# EAGLE board driver (EAGLE 9.4.2)
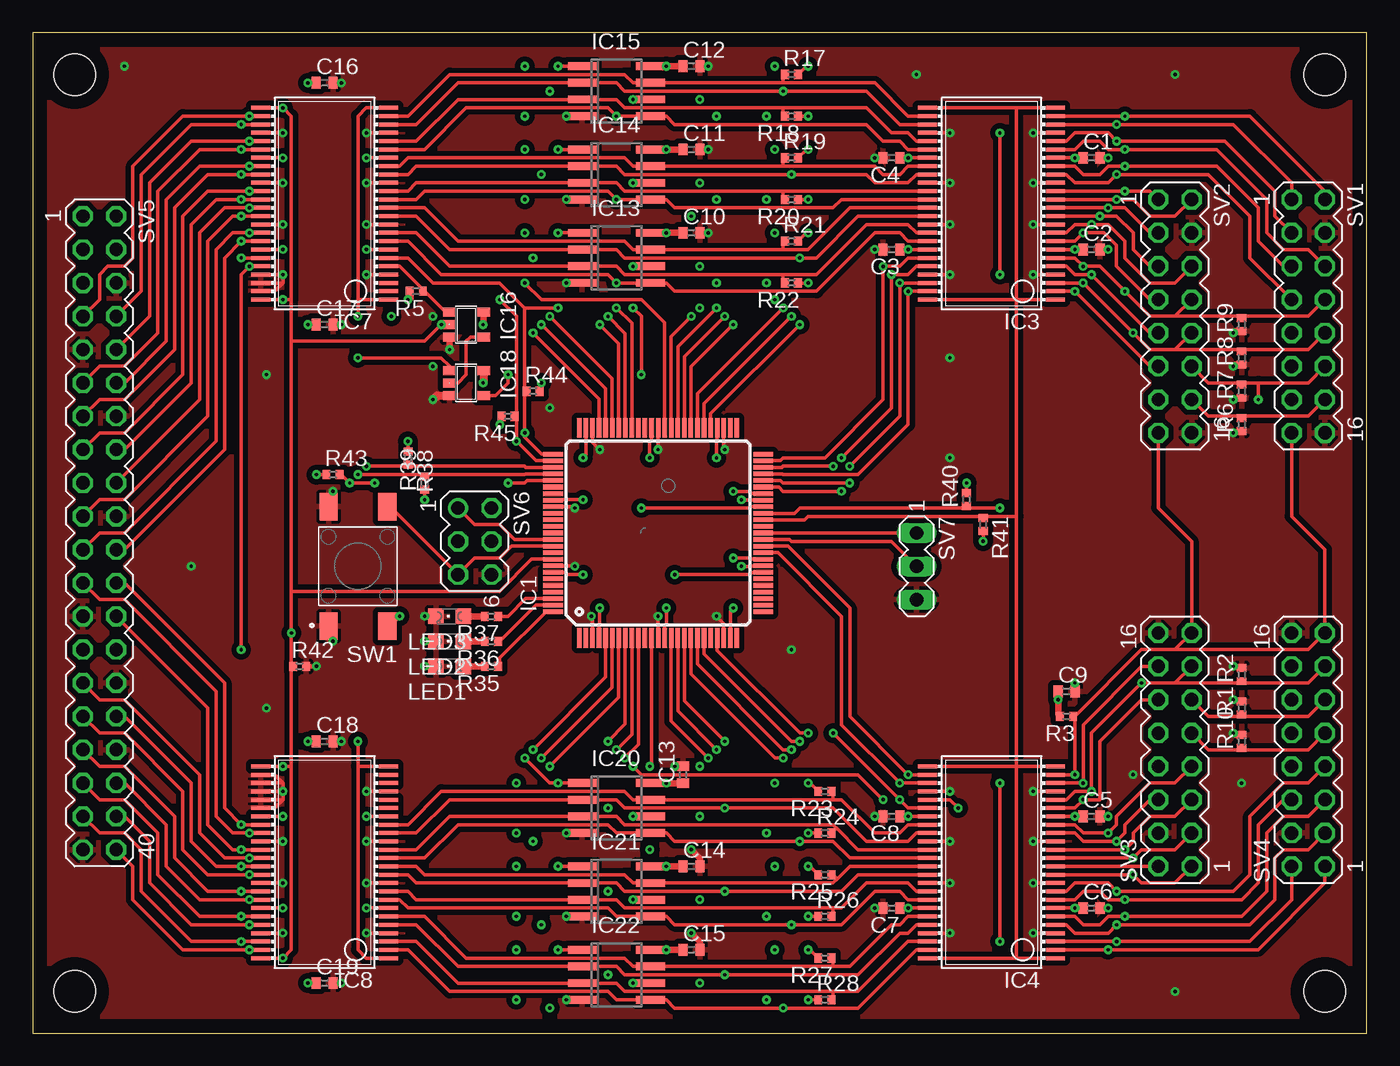
[diagram p2: board, top side]
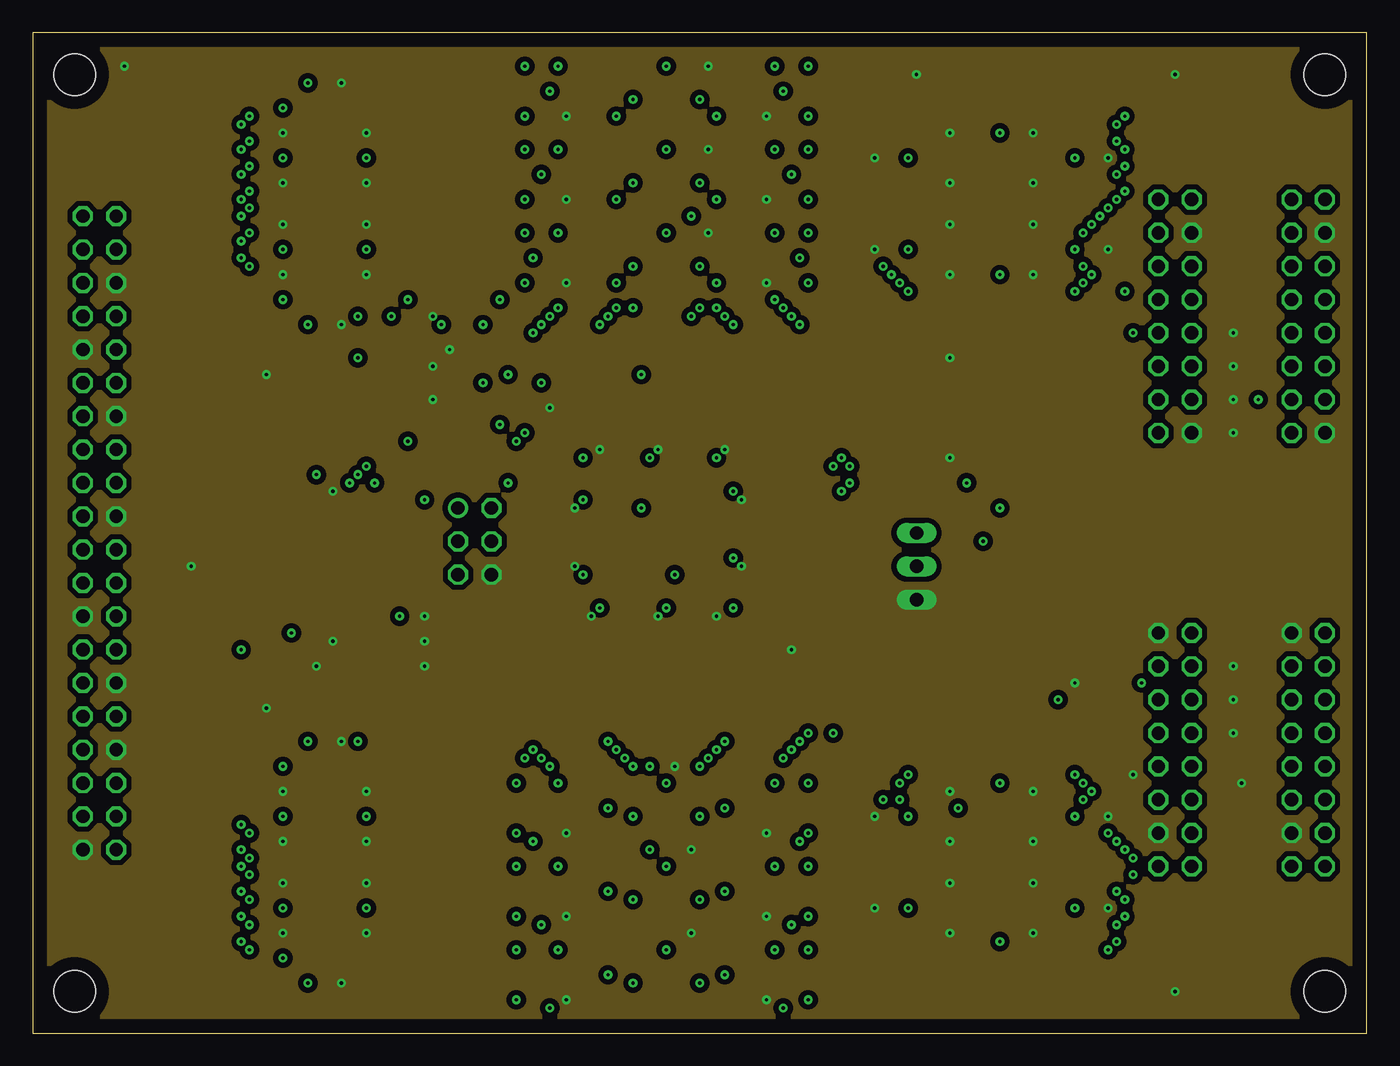
[diagram p3: board, inner layer Route2]
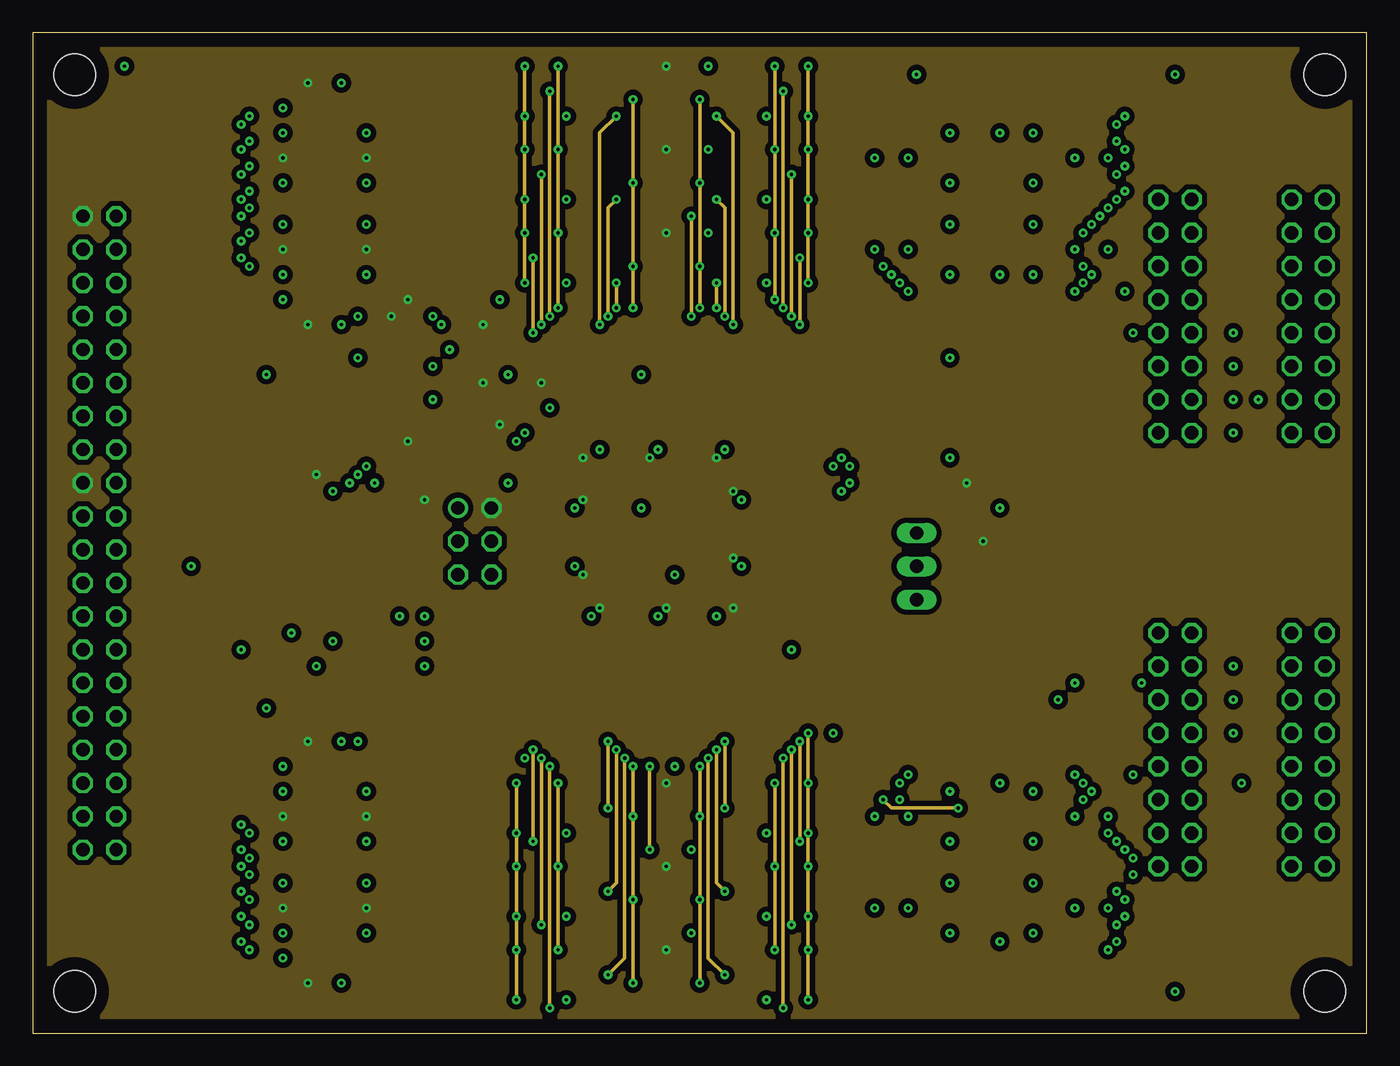
[diagram p4: board, inner layer Route15]
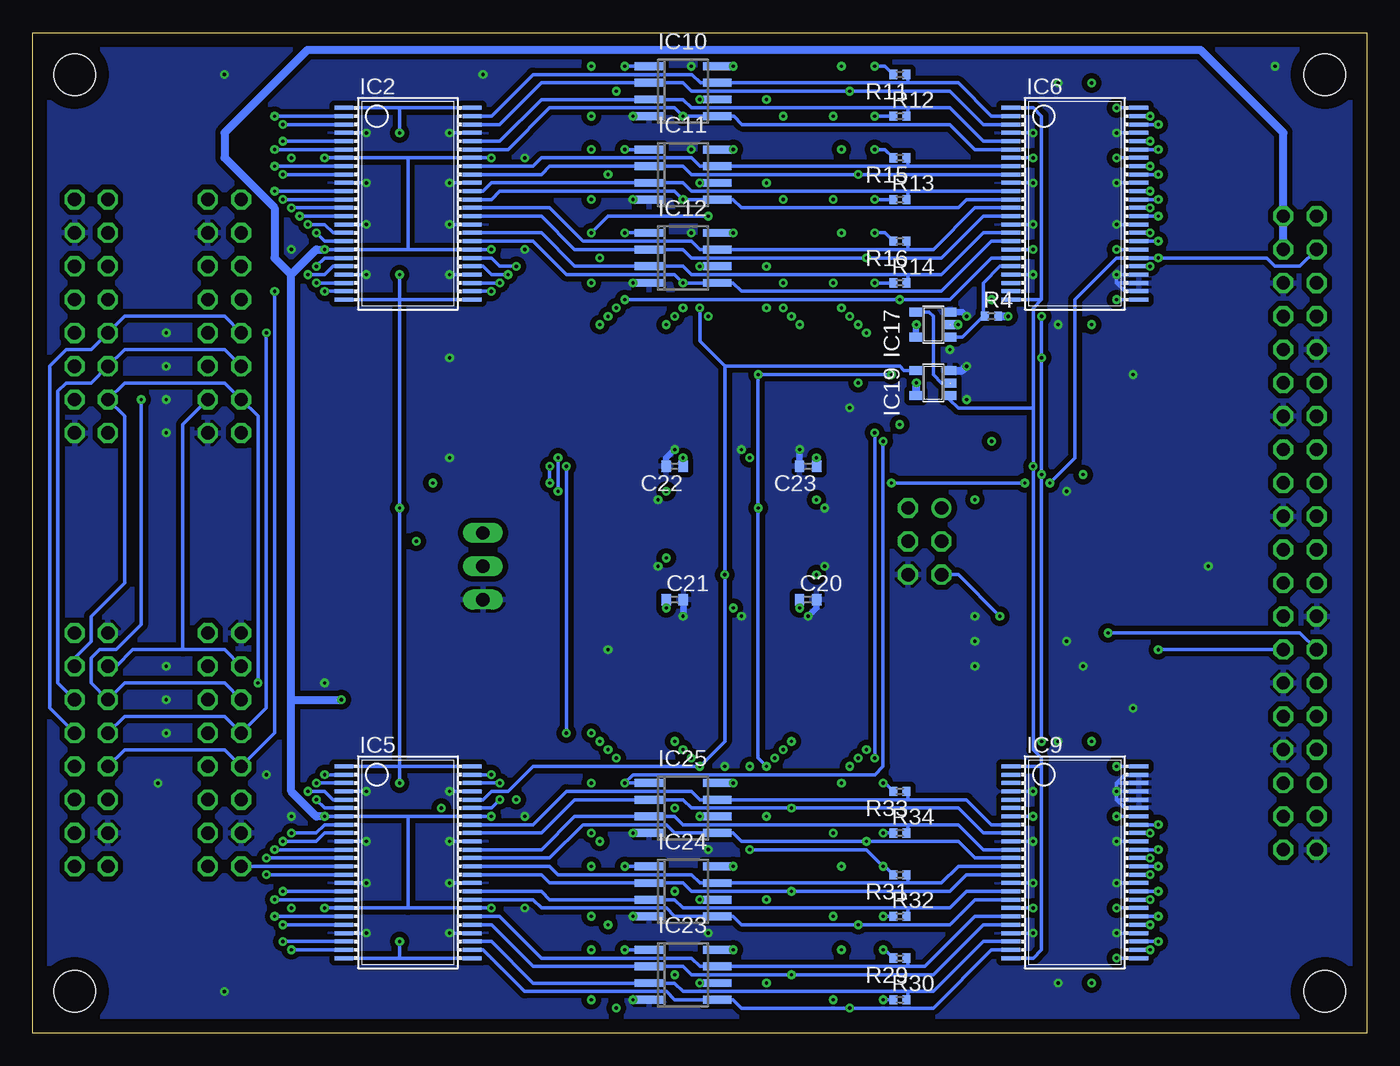
[diagram p5: board, bottom side, seen from below]

Size 101.6 x 76.2 mm. Coordinates in mm from the lower left corner, seen from the top.
Outline: 0,76.2 0,0 101.6,0 101.6,76.2 0,76.2
Copper layers (1*2*15*16): Top 0.035mm / dielectric 0.5mm / Route2 0.035mm / dielectric 0.5mm / Route15 0.035mm / dielectric 0.5mm / Bottom 0.035mm
Design rules "66each *": minimum track width 5mil, minimum drill 10mil, track to track 5mil, track to pad 5mil, pad to pad 5mil, via to via 5mil, smd to smd 5mil, copper to edge 40mil, drill to drill 8mil, minimum pad ring 10mil, minimum via ring 8mil, stop-mask expansion 4mil, vias tented up to drill 0mil, thermal gap 10mil
Holes 3.17 mm at 98.42,73.03 3.17,73.03 98.42,3.17 3.17,3.17

## Footprints (pad centres in the part's own frame; a part is rotated, then mirrored left to right if it is on the bottom)
C0402 = smd 0.7 x 0.9: 1 -0.65,0; 2 0.65,0
TQFP100 = smd 1.5 x 0.35: 1 -8,6; 2 -8,5.5; 3 -8,5; 4 -8,4.5; 5 -8,4; 6 -8,3.5; 7 -8,3; 8 -8,2.5; 9 -8,2; 10 -8,1.5; 11 -8,1; 12 -8,0.5; 13 -8,0; 14 -8,-0.5; 15 -8,-1; 16 -8,-1.5; 17 -8,-2; 18 -8,-2.5; 19 -8,-3; 20 -8,-3.5; 21 -8,-4; 22 -8,-4.5; 23 -8,-5; 24 -8,-5.5; 25 -8,-6; 51 8,-6; 52 8,-5.5; 53 8,-5; 54 8,-4.5; 55 8,-4; 56 8,-3.5; 57 8,-3; 58 8,-2.5; 59 8,-2; 60 8,-1.5; 61 8,-1; 62 8,-0.5; 63 8,0; 64 8,0.5; 65 8,1; 66 8,1.5; 67 8,2; 68 8,2.5; 69 8,3; 70 8,3.5; 71 8,4; 72 8,4.5; 73 8,5; 74 8,5.5; 75 8,6 | smd 0.35 x 1.5: 26 -6,-8; 27 -5.5,-8; 28 -5,-8; 29 -4.5,-8; 30 -4,-8; 31 -3.5,-8; 32 -3,-8; 33 -2.5,-8; 34 -2,-8; 35 -1.5,-8; 36 -1,-8; 37 -0.5,-8; 38 0,-8; 39 0.5,-8; 40 1,-8; 41 1.5,-8; 42 2,-8; 43 2.5,-8; 44 3,-8; 45 3.5,-8; 46 4,-8; 47 4.5,-8; 48 5,-8; 49 5.5,-8; 50 6,-8; 76 6,8; 77 5.5,8; 78 5,8; 79 4.5,8; 80 4,8; 81 3.5,8; 82 3,8; 83 2.5,8; 84 2,8; 85 1.5,8; 86 1,8; 87 0.5,8; 88 0,8; 89 -0.5,8; 90 -1,8; 91 -1.5,8; 92 -2,8; 93 -2.5,8; 94 -3,8; 95 -3.5,8; 96 -4,8; 97 -4.5,8; 98 -5,8; 99 -5.5,8; 100 -6,8
SSOP48DL = smd 0.305 x 1.422: 1 -6.985,-4.877; 2 -6.35,-4.877; 3 -5.715,-4.877; 4 -5.08,-4.877; 5 -4.445,-4.877; 6 -3.81,-4.877; 7 -3.175,-4.877; 8 -2.54,-4.877; 9 -1.905,-4.877; 10 -1.27,-4.877; 11 -0.635,-4.877; 12 0,-4.877; 13 0.635,-4.877; 14 1.27,-4.877; 15 1.905,-4.877; 16 2.54,-4.877; 17 3.175,-4.877; 18 3.81,-4.877; 19 4.445,-4.877; 20 5.08,-4.877; 21 5.715,-4.877; 22 6.35,-4.877; 23 6.985,-4.877; 24 7.62,-4.877; 25 7.62,4.877; 26 6.985,4.877; 27 6.35,4.877; 28 5.715,4.877; 29 5.08,4.877; 30 4.445,4.877; 31 3.81,4.877; 32 3.175,4.877; 33 2.54,4.877; 34 1.905,4.877; 35 1.27,4.877; 36 0.635,4.877; 37 0,4.877; 38 -0.635,4.877; 39 -1.27,4.877; 40 -1.905,4.877; 41 -2.54,4.877; 42 -3.175,4.877; 43 -3.81,4.877; 44 -4.445,4.877; 45 -5.08,4.877; 46 -5.715,4.877; 47 -6.35,4.877; 48 -6.985,4.877
SO08 = smd 0.6 x 2.2: 1 -1.905,-2.6; 2 -0.635,-2.6; 3 0.635,-2.6; 4 1.905,-2.6; 5 1.905,2.6; 6 0.635,2.6; 7 -0.635,2.6; 8 -1.905,2.6
SOT23-5 = smd 0.69 x 0.99: 1 -0.95,-1.29; 2 0,-1.29; 3 0.95,-1.29; 4 0.95,1.3; 5 -0.95,1.3
CHIPLED_0805 = smd 1.2 x 1.2: A 0,-1.05; C 0,1.05
R0402 = smd 0.6 x 0.7: 1 -0.5,0; 2 0.5,0
MA08-2 = drill 1.016 octagon: 1 -8.89,-1.27; 2 -8.89,1.27; 3 -6.35,-1.27; 4 -6.35,1.27; 5 -3.81,-1.27; 6 -3.81,1.27; 7 -1.27,-1.27; 8 -1.27,1.27; 9 1.27,-1.27; 10 1.27,1.27; 11 3.81,-1.27; 12 3.81,1.27; 13 6.35,-1.27; 14 6.35,1.27; 15 8.89,-1.27; 16 8.89,1.27
MA20-2 = drill 1.016 octagon: 1 -24.13,-1.27; 2 -24.13,1.27; 3 -21.59,-1.27; 4 -21.59,1.27; 5 -19.05,-1.27; 6 -19.05,1.27; 7 -16.51,-1.27; 8 -16.51,1.27; 9 -13.97,-1.27; 10 -13.97,1.27; 11 -11.43,-1.27; 12 -11.43,1.27; 13 -8.89,-1.27; 14 -8.89,1.27; 15 -6.35,-1.27; 16 -6.35,1.27; 17 -3.81,-1.27; 18 -3.81,1.27; 19 -1.27,-1.27; 20 -1.27,1.27; 21 1.27,-1.27; 22 1.27,1.27; 23 3.81,-1.27; 24 3.81,1.27; 25 6.35,-1.27; 26 6.35,1.27; 27 8.89,-1.27; 28 8.89,1.27; 29 11.43,-1.27; 30 11.43,1.27; 31 13.97,-1.27; 32 13.97,1.27; 33 16.51,-1.27; 34 16.51,1.27; 35 19.05,-1.27; 36 19.05,1.27; 37 21.59,-1.27; 38 21.59,1.27; 39 24.13,-1.27; 40 24.13,1.27
MA03-2 = drill 1.016: 1 -2.54,-1.27 | drill 1.016 octagon: 2 -2.54,1.27; 3 0,-1.27; 4 0,1.27; 5 2.54,-1.27; 6 2.54,1.27
MA03-1 = drill 1.016 long: 1 -2.54,0; 2 0,0; 3 2.54,0
FSM2JSMA = smd 1.4 x 2.1: 1 2.23,4.55; 2 2.23,-4.55; 3 -2.23,4.55; 4 -2.23,-4.55

## Placement (x,y rotation side)
C1  100n  [C0402]  80.64,66.67 0 top
C2  100n  [C0402]  80.64,59.69 0 top
C3  100n  [C0402]  65.41,59.69 180 top
C4  100n  [C0402]  65.41,66.67 180 top
C5  100n  [C0402]  80.64,16.51 0 top
C6  100n  [C0402]  80.64,9.53 0 top
C7  100n  [C0402]  65.41,9.53 180 top
C8  100n  [C0402]  65.41,16.51 180 top
C9  100n  [C0402]  78.74,26.04 0 top
C10  100n  [C0402]  50.16,60.96 0 top
C11  100n  [C0402]  50.16,67.31 0 top
C12  100n  [C0402]  50.16,73.66 0 top
C13  100n  [C0402]  49.53,19.68 90 top
C14  100n  [C0402]  50.16,12.7 0 top
C15  100n  [C0402]  50.16,6.35 0 top
C16  100n  [C0402]  22.23,72.39 0 top
C17  100n  [C0402]  22.23,53.98 0 top
C18  100n  [C0402]  22.23,22.23 0 top
C19  100n  [C0402]  22.23,3.81 0 top
C20  100n  [C0402]  42.55,33.02 0 bottom
C21  100n  [C0402]  52.7,33.02 0 bottom
C22  100n  [C0402]  52.7,43.18 180 bottom
C23  100n  [C0402]  42.55,43.18 180 bottom
IC1  XMEGA128A1  [TQFP100]  47.62,38.1 90 top
IC2  74AC16244  [SSOP48DL]  73.03,63.5 270 bottom
IC3  74AC16244  [SSOP48DL]  73.03,62.87 90 top
IC4  74AC16244  [SSOP48DL]  73.03,12.7 90 top
IC5  74AC16244  [SSOP48DL]  73.03,13.34 270 bottom
IC6  74AC16374  [SSOP48DL]  22.23,63.5 270 bottom
IC7  74AC16374  [SSOP48DL]  22.23,62.87 90 top
IC8  74AC16374  [SSOP48DL]  22.23,12.7 90 top
IC9  74AC16374  [SSOP48DL]  22.23,13.34 270 bottom
IC10  ST95P08M  [SO08]  52.07,71.75 270 bottom
IC11  ST95P08M  [SO08]  52.07,65.41 270 bottom
IC12  ST95P08M  [SO08]  52.07,59.05 270 bottom
IC13  ST95P08M  [SO08]  44.45,59.05 270 top
IC14  ST95P08M  [SO08]  44.45,65.41 270 top
IC15  ST95P08M  [SO08]  44.45,71.75 270 top
IC16  74AHC1G02DBV  [SOT23-5]  33.02,53.98 270 top
IC17  74AHC1G02DBV  [SOT23-5]  33.02,53.98 90 bottom
IC18  74AHC1G125DBV  [SOT23-5]  33.02,49.53 270 top
IC19  74AHC1G125DBV  [SOT23-5]  33.02,49.53 90 bottom
IC20  ST95P08M  [SO08]  44.45,17.14 270 top
IC21  ST95P08M  [SO08]  44.45,10.79 270 top
IC22  ST95P08M  [SO08]  44.45,4.45 270 top
IC23  ST95P08M  [SO08]  52.07,4.45 270 bottom
IC24  ST95P08M  [SO08]  52.07,10.79 270 bottom
IC25  ST95P08M  [SO08]  52.07,17.14 270 bottom
LED1  [CHIPLED_0805]  31.75,27.94 90 top
LED2  [CHIPLED_0805]  31.75,29.84 90 top
LED3  [CHIPLED_0805]  31.75,31.75 90 top
R1  47k  [R0402]  92.08,24.77 90 top
R2  47k  [R0402]  92.08,27.3 90 top
R3  47k  [R0402]  78.74,24.13 180 top
R4  33k  [R0402]  28.57,54.61 0 bottom
R5  33k  [R0402]  29.21,56.52 180 top
R6  47k  [R0402]  92.08,46.35 90 top
R7  47k  [R0402]  92.08,48.9 90 top
R8  47k  [R0402]  92.08,51.44 90 top
R9  47k  [R0402]  92.08,53.98 90 top
R10  47k  [R0402]  92.08,22.23 90 top
R11  33k  [R0402]  35.56,73.03 180 bottom
R12  33k  [R0402]  35.56,69.85 0 bottom
R13  33k  [R0402]  35.56,63.5 0 bottom
R14  33k  [R0402]  35.56,57.15 0 bottom
R15  33k  [R0402]  35.56,66.67 180 bottom
R16  33k  [R0402]  35.56,60.33 180 bottom
R17  33k  [R0402]  57.78,73.03 0 top
R18  33k  [R0402]  57.78,69.85 180 top
R19  33k  [R0402]  57.78,66.67 0 top
R20  33k  [R0402]  57.78,63.5 180 top
R21  33k  [R0402]  57.78,60.33 0 top
R22  33k  [R0402]  57.78,57.15 180 top
R23  33k  [R0402]  60.33,18.41 180 top
R24  33k  [R0402]  60.33,15.24 0 top
R25  33k  [R0402]  60.33,12.06 180 top
R26  33k  [R0402]  60.33,8.89 0 top
R27  33k  [R0402]  60.33,5.71 180 top
R28  33k  [R0402]  60.33,2.54 0 top
R29  33k  [R0402]  35.56,5.71 180 bottom
R30  33k  [R0402]  35.56,2.54 0 bottom
R31  33k  [R0402]  35.56,12.06 180 bottom
R32  33k  [R0402]  35.56,8.89 0 bottom
R33  33k  [R0402]  35.56,18.41 180 bottom
R34  33k  [R0402]  35.56,15.24 0 bottom
R35  330  [R0402]  34.92,27.94 180 top
R36  330  [R0402]  34.92,29.84 180 top
R37  330  [R0402]  34.92,31.75 180 top
R38  33k  [R0402]  28.57,43.81 270 top
R39  33k  [R0402]  29.84,41.91 90 top
R40  33k  [R0402]  71.12,40.64 90 top
R41  33k  [R0402]  72.39,38.73 270 top
R42  33k  [R0402]  20.32,27.94 0 top
R43  33k  [R0402]  22.86,42.55 0 top
R44  33k  [R0402]  38.1,48.9 0 top
R45  33k  [R0402]  36.2,46.99 180 top
SV1  [MA08-2]  97.16,54.61 270 top
SV2  [MA08-2]  87,54.61 270 top
SV3  [MA08-2]  87,21.59 90 top
SV4  [MA08-2]  97.16,21.59 90 top
SV5  [MA20-2]  5.08,38.1 270 top
SV6  [MA03-2]  33.66,37.47 270 top
SV7  [MA03-1]  67.31,35.56 270 top
SW1  FSM2JSMA  [FSM2JSMA]  24.77,35.56 180 top

## Tracks (layer width: path | path; a pad name or v marks a point on that pad's centre or on a via)
!CS0  (via drill 0.25)
  Top 0.254: IC1.77 38.31,43.6 v36.83,45.09 36.83,46.99 | 36.83,46.99 36.83,54.61 v35.56,55.88 | R45.1 36.83,46.99
  Route15 0.254: v56.52,73.66 v56.52,67.31 v56.52,60.96 v56.52,55.88 | v56.52,6.35 v56.52,12.7 v56.52,19.05
  Bottom 0.254: IC6.19 28.57,59.05 31.75,55.88 v35.56,55.88 v56.52,55.88 | IC10.1 v56.52,73.66 | IC11.1 v56.52,67.31 | IC12.1 v56.52,60.96 | IC23.1 v56.52,6.35 | IC24.1 v56.52,12.7 | IC25.1 v56.52,19.05 55.88,19.68 37.47,19.68 36.83,20.32 v36.83,45.09
!CS1  (via drill 0.25)
  Top 0.254: IC7.6 28.57,59.05 30.48,57.15 35.56,57.15 37.47,55.24 | 37.47,48.9 v37.47,45.72 37.47,45.4 38.77,44.1 IC1.76 | 37.47,48.9 37.47,55.24 | IC15.1 v40.01,73.66 | IC14.1 v40.01,67.31 | IC13.1 v40.01,60.96 | v40.01,55.24 37.47,55.24 | IC22.1 v40.01,6.35 | IC21.1 v40.01,12.7 | IC20.1 v40.01,19.05 39.37,19.05 v37.47,20.95 | R44.1 37.47,48.9
  Route15 0.254: v40.01,73.66 v40.01,67.31 v40.01,60.96 v40.01,55.24 | v40.01,6.35 v40.01,12.7 v40.01,19.05
  Bottom 0.254: v37.47,45.72 v37.47,20.95
A  (via drill 0.25)
  Top 0.254: IC3.44 67.31,58.42 66.67,57.78 v65.41,57.78 65.41,47.62 v61.59,43.81 | v61.59,41.27 57.15,41.27 56.83,41.6 IC1.45
  Bottom 0.254: IC3.44 67.31,58.42 66.67,57.78 v65.41,57.78 | v61.59,41.27 v61.59,43.81
B  (via drill 0.25)
  Top 0.254: IC3.46 v66.04,57.15 66.04,46.99 v62.23,43.18 | v62.23,41.91 57.15,41.91 56.96,42.1 IC1.46
  Bottom 0.254: v66.04,57.15 IC3.46 | v62.23,41.91 v62.23,43.18
C  (via drill 0.25)
  Top 0.254: IC3.47 v66.67,56.52 66.67,46.35 62.87,42.55 57.15,42.55 57.09,42.6 IC1.47
  Bottom 0.254: IC3.47 v66.67,56.52
CLKIN  (via drill 0.25)
  Top 0.254: IC16.2 v31.11,53.98 29.84,52.7 19.68,52.7 | IC7.25 v19.05,70.48 19.68,69.85 19.68,55.88 | 19.68,55.88 v19.05,55.88 IC6.25 | 19.68,33.66 v19.68,30.48 19.68,27.94 | 19.68,33.66 19.68,52.7 | 19.68,52.7 19.68,55.88 | 19.68,27.94 19.68,20.32 | 19.68,20.32 19.68,6.35 v19.05,5.71 IC8.48 | IC8.25 v19.05,20.32 19.68,20.32 | IC1.92 38.01,36.1 35.56,33.66 19.68,33.66 | R42.1 19.68,27.94
  Bottom 0.254: IC16.2 v31.11,53.98 | IC7.25 v19.05,70.48 | IC6.25 v19.05,55.88 | SV5.27 5.08,30.48 v19.68,30.48 | IC8.25 v19.05,20.32 | IC8.48 v19.05,5.71
D  (via drill 0.25)
  Top 0.254: v60.96,22.86 v66.04,17.78 66.67,17.14 IC5.43 | v60.96,43.18 57.15,43.18 57.07,43.1 IC1.48
  Bottom 0.254: v60.96,43.18 v60.96,22.86 | IC5.43 66.67,17.14 v66.04,17.78
E  (via drill 0.25)
  Top 0.254: IC3.43 66.67,59.05 66.04,58.42 v64.77,58.42 64.77,48.26 60.33,43.81 57.15,43.81 56.94,43.6 IC1.49
  Bottom 0.254: v64.77,58.42 66.04,58.42 66.67,59.05 IC3.43
GND  (via drill 0.25)
  Top 0.254: IC3.28 v69.85,68.58 | IC3.34 v69.85,64.77 | IC3.39 v69.85,61.59 | IC2.28 v69.85,57.78 | v76.2,68.58 IC3.21 | v76.2,64.77 IC3.15 | v76.2,61.59 IC3.10 | v76.2,57.78 IC2.21 | C1.2 v81.92,66.67 | C2.2 v81.92,59.69 | C4.2 v64.14,66.67 | C3.2 v64.14,59.69 | C8.2 v64.14,16.51 | C7.2 v64.14,9.53 | C5.2 v81.92,16.51 | C6.2 v81.92,9.53 | IC5.45 v69.85,18.41 | IC5.39 v69.85,14.61 | IC5.34 v69.85,11.43 | IC5.28 v69.85,7.62 | IC5.21 v76.2,7.62 | IC5.15 v76.2,11.43 | IC5.10 v76.2,14.61 | IC5.4 v76.2,18.41 | C9.2 79.38,26.05 | IC7.21 v25.4,68.58 | IC7.15 v25.4,64.77 | IC7.10 v25.4,61.59 | IC6.21 v25.4,57.78 | IC6.28 v19.05,57.78 19.05,57.15 | IC7.39 v19.05,61.59 | IC7.34 v19.05,64.77 | IC7.28 v19.05,68.58 | IC1.53 52.62,44.53 v52.7,44.45 | IC1.33 54.65,35.6 54.61,35.56 v53.98,35.56 | IC1.63 v47.62,44.45 | IC1.43 54.02,40.6 v53.98,40.64 | IC6.26 18.41,56.52 19.05,57.15 | IC9.45 v19.05,18.41 | IC9.39 v19.05,14.61 | v25.4,18.41 IC9.4 | v25.4,14.61 IC9.10 | v25.4,11.43 IC9.15 | v25.4,7.62 IC9.21 | IC9.28 v19.05,7.62 | IC9.34 v19.05,11.43 | IC8.26 18.41,19.68 19.05,19.05 | 19.05,19.05 v19.05,18.41 | IC1.73 42.62,45.01 v43.18,44.45 | IC1.84 41.18,40.1 v41.27,40.01 | IC1.93 41.23,35.6 v41.27,35.56 | IC1.3 42.62,31.67 v42.55,31.75 | IC1.13 v47.62,31.75 | IC1.23 52.62,31.2 v52.07,31.75 | IC9.44 19.05,17.78 | 19.05,17.78 v19.05,18.41 | IC9.46 19.05,19.05 | SW1.2 22.54,40.95 v22.86,41.27 | SW1.1 22.86,30.68 v22.86,29.84 | IC9.43 18.41,17.14 19.05,17.78 | IC7.46 19.05,57.15 | R42.2 v21.59,27.94
  Top 0.508: 79.38,26.05 v79.38,26.67 | IC14.4 v40.64,63.5 | IC13.4 v40.64,57.15 | IC15.4 v40.64,69.85 | C12.2 v51.44,73.66 | C11.2 v51.44,67.31 | C10.2 v51.44,60.96 | IC16.3 31.73,52.09 v31.75,52.07 | IC20.4 v40.64,15.24 | IC21.4 v40.64,8.89 | IC22.4 v40.64,2.54 | C14.2 50.81,13.32 v50.16,13.97 | C13.2 49.52,20.32 v48.9,20.32 | C15.2 50.81,6.97 v50.16,7.62 | R10.2 91.58,22.73 v91.44,22.86 | R8.1 91.58,50.94 v91.44,50.8 | R9.1 91.58,53.48 v91.44,53.34 | C16.2 v23.5,72.39 | C17.2 v23.5,53.98 | C18.2 v23.5,22.23 | C19.2 v23.5,3.81 | LED3.C v29.84,31.75 | LED2.C v29.84,29.84 | LED1.C v29.84,27.94
  Top 0.61: v30.48,48.26 30.8,48.58 IC18.3
  Bottom 0.254: IC3.28 v69.85,68.58 | IC3.34 v69.85,64.77 | IC3.39 v69.85,61.59 | IC2.28 v69.85,57.78 | v76.2,68.58 IC3.21 | v76.2,64.77 IC3.15 | v76.2,61.59 IC3.10 | v76.2,57.78 IC2.21 | IC5.28 v69.85,7.62 | IC5.34 v69.85,11.43 | IC5.39 v69.85,14.61 | IC5.45 v69.85,18.41 | IC5.4 v76.2,18.41 | IC5.10 v76.2,14.61 | IC5.15 v76.2,11.43 | IC5.21 v76.2,7.62 | IC7.28 v19.05,68.58 | IC7.34 v19.05,64.77 | IC7.39 v19.05,61.59 | IC6.28 v19.05,57.78 19.05,57.15 | IC7.10 v25.4,61.59 | IC7.15 v25.4,64.77 | IC7.21 v25.4,68.58 | IC6.21 v25.4,57.78 | IC6.26 18.41,56.52 19.05,57.15 | IC9.28 v19.05,7.62 | IC9.34 v19.05,11.43 | IC9.39 v19.05,14.61 | IC9.4 v25.4,18.41 | IC9.10 v25.4,14.61 | IC9.15 v25.4,11.43 | IC9.21 v25.4,7.62 | IC8.26 18.41,19.68 19.05,19.05 | 19.05,19.05 v19.05,18.41 | IC9.46 19.05,19.05 | IC9.45 v19.05,18.41 | IC9.44 19.05,17.78 | 19.05,17.78 v19.05,18.41 | IC9.43 18.41,17.14 19.05,17.78 | IC7.46 19.05,57.15
  Bottom 0.508: IC10.4 v55.88,69.85 | IC11.4 v55.88,63.5 | IC12.4 v55.88,57.15 | IC17.3 30.8,54.92 v30.48,54.61 | IC25.4 v55.88,15.24 | IC23.4 v55.88,2.54 | IC24.4 v55.88,8.89 | C23.2 43.2,44.44 v43.18,44.45 | C22.2 53.35,43.8 v52.7,44.45 | C20.2 41.9,32.4 v42.55,31.75 | C21.2 52.05,31.77 v52.07,31.75
  Bottom 0.61: IC19.3 30.8,50.48 v30.48,50.8
  other vias: 91.44,27.94 91.44,25.4 91.44,48.26 91.44,45.72 17.78,50.16 17.78,24.77 57.78,29.21 39.37,47.62 69.85,51.44 69.85,43.81 83.82,19.68 92.08,19.05 87,3.17 6.99,73.66 67.31,73.03 87,73.03 12.06,35.56
  pour Route2 (isolate 0.406, no thermals): 100.33,74.93 100.33,1.27 1.27,1.27 1.27,74.93
  pour Top (isolate 0.406): 1.27,74.93 100.33,74.93 100.33,1.27 1.27,1.27
  pour Bottom (isolate 0.406): 1.27,74.93 100.33,74.93 100.33,1.27 1.27,1.27
IEN0  (via drill 0.25)
  Top 0.254: IC1.78 37.55,43.1 37.46,43.18 28.57,43.18 | 28.57,43.18 v25.4,43.18 | R38.2 28.57,43.18
  Bottom 0.254: IC6.1 25.4,70.48 24.77,69.85 24.77,55.88 | IC6.24 24.77,55.88 | 24.77,55.88 25.4,55.24 25.4,47.62 | 25.4,47.62 v25.4,43.18 25.4,21.59 24.77,20.95 24.77,20.32 | 24.77,20.32 24.77,6.35 25.4,5.71 IC9.24 | IC9.1 24.77,20.32 | IC19.1 31.73,48.24 31.11,47.62 25.4,47.62
IEN1  (via drill 0.25)
  Top 0.254: IC1.79 37.52,42.6 37.47,42.55 29.84,42.55 | 29.84,42.55 v24.77,42.55 | IC7.24 25.4,70.48 24.77,69.85 24.77,55.88 | 24.77,55.88 v24.77,54.61 | IC7.1 24.77,55.88 | v24.77,22.23 24.77,20.32 | 24.77,20.32 24.77,6.35 25.4,5.71 IC8.1 | IC8.24 24.77,20.32 | R39.2 29.84,42.55 | IC18.1 31.73,50.82 31.11,51.44 v24.77,51.44
  Bottom 0.254: v24.77,22.23 v24.77,42.55 v24.77,51.44 v24.77,54.61
LAT  (via drill 0.25)
  Top 0.254: IC1.35 56.74,36.6 61.59,31.75 61.59,23.5 v66.04,19.05 IC5.46
  Bottom 0.254: IC5.46 v66.04,19.05
N$1  (via drill 0.25)
  Top 0.254: SV1.2 98.42,64.14 92.71,69.85 v83.19,69.85 IC3.23
  Bottom 0.254: IC3.23 v83.19,69.85
N$2  (via drill 0.25)
  Top 0.254: SV1.1 95.89,64.77 91.44,69.22 v82.55,69.22 IC3.22
  Bottom 0.254: IC3.22 v82.55,69.22
N$3  (via drill 0.25)
  Top 0.254: SV1.6 97.16,59.69 95.25,59.69 93.98,60.96 93.98,63.5 90.17,67.31 v83.19,67.31 81.92,67.31 81.28,67.94 80.01,67.94 79.38,67.31 IC3.19
  Bottom 0.254: IC3.19 v83.19,67.31
N$4  (via drill 0.25)
  Top 0.254: SV1.3 94.61,62.23 94.61,64.14 90.81,67.94 v82.55,67.94 81.92,68.58 79.38,68.58 78.74,67.94 IC2.5
  Bottom 0.254: IC2.5 v82.55,67.94
N$5  (via drill 0.25)
  Top 0.254: SV1.5 95.25,58.42 93.34,60.33 93.34,62.87 90.17,66.04 v83.19,66.04 81.92,66.04 81.28,65.41 80.01,65.41 79.38,66.04 IC3.17
  Bottom 0.254: IC3.17 v83.19,66.04
N$6  (via drill 0.25)
  Top 0.254: IC3.16 78.74,65.41 79.38,64.77 81.92,64.77 v82.55,65.41 89.53,65.41 92.71,62.23 92.71,59.05 SV1.7
  Bottom 0.254: IC3.16 v82.55,65.41
N$7  (via drill 0.25)
  Top 0.254: SV2.2 87,62.23 85.09,62.23 83.82,63.5 v82.55,63.5 IC2.12
  Bottom 0.254: IC2.12 v82.55,63.5
N$8  (via drill 0.25)
  Top 0.254: IC2.14 v81.28,62.23 82.55,62.23 83.82,60.96 83.82,59.69 85.09,58.42 SV2.5
  Bottom 0.254: IC2.14 v81.28,62.23
N$9  (via drill 0.25)
  Top 0.254: IC2.13 v81.92,62.87 83.19,62.87 85.09,60.96 SV2.3
  Bottom 0.254: IC2.13 v81.92,62.87
N$10  (via drill 0.25)
  Top 0.254: SV2.6 87,57.15 85.09,57.15 83.19,59.05 83.19,60.33 81.92,61.59 v80.64,61.59 79.38,61.59 78.74,60.96 IC2.16
  Bottom 0.254: IC2.16 78.74,60.96 79.38,61.59 v80.64,61.59
N$11  (via drill 0.25)
  Top 0.254: SV1.8 97.16,54.61 92.08,54.61 | 92.08,54.61 87,54.61 | 87,54.61 85.09,54.61 v83.19,56.52 81.28,58.42 v80.01,58.42 79.38,59.05 IC3.6 | SV2.8 87,54.61 | R9.2 92.08,54.61
  Bottom 0.254: IC3.6 79.38,59.05 v80.01,58.42 | SV4.8 94.61,21.59 87,21.59 SV3.8 83.19,22.86 v83.19,56.52
N$12  (via drill 0.25)
  Top 0.254: IC2.20 78.74,58.42 79.38,57.78 v80.64,57.78 85.09,53.34 SV2.9 | SV3.9 89.53,21.59 92.08,21.59 | 92.08,21.59 97.16,21.59 SV4.9 | R10.1 92.08,21.59
  Bottom 0.254: SV2.9 87,54.61 94.61,54.61 SV1.9 97.16,52.07 99.06,52.07 100.33,50.8 100.33,24.77 SV4.9 | IC2.20 78.74,58.42 79.38,57.78 v80.64,57.78
N$13  (via drill 0.25)
  Top 0.254: IC3.14 v83.19,64.14 85.09,64.14 SV2.1
  Bottom 0.254: IC3.14 v83.19,64.14
N$14  (via drill 0.25)
  Top 0.254: IC3.2 v79.38,56.52 85.09,50.8 SV2.11 | SV3.11 89.53,24.13 92.08,24.13 | 92.08,24.13 97.16,24.13 SV4.11 | R1.1 92.08,24.13
  Bottom 0.254: SV2.11 87,52.07 94.61,52.07 SV1.11 97.16,49.53 99.06,49.53 99.69,48.9 99.69,26.67 SV4.11 | IC3.2 v79.38,56.52
N$15  (via drill 0.25)
  Top 0.254: SV2.10 87,52.07 | 87,52.07 85.09,52.07 v83.82,53.34 v80.01,57.15 IC3.3 | SV1.10 97.16,52.07 92.08,52.07 | 92.08,52.07 87,52.07 | R8.2 92.08,52.07
  Bottom 0.254: IC3.3 v80.01,57.15 | SV4.10 94.61,24.13 87,24.13 SV3.10 83.82,24.77 v83.82,53.34
N$17  (via drill 0.25)
  Top 0.254: IC4.19 79.38,17.14 v80.01,17.78 81.28,17.78 81.28,22.23 84.45,25.4 SV3.12 | SV2.12 89.53,49.53 92.08,49.53 | 92.08,49.53 93.34,49.53 | 93.34,49.53 97.16,49.53 SV1.12 | 93.34,49.53 v93.34,48.26 | R7.2 92.08,49.53
  Bottom 0.254: IC4.19 79.38,17.14 v80.01,17.78 | SV3.12 87,26.67 94.61,26.67 SV4.12 97.16,26.67 97.16,28.57 96.52,29.21 95.25,29.21 93.34,31.11 v93.34,48.26
N$18  (via drill 0.25)
  Top 0.254: IC3.8 79.38,60.33 v80.01,60.96 81.6,60.96 82.55,60.01 82.55,58.42 85.09,55.88 SV2.7
  Bottom 0.254: IC3.8 79.38,60.33 v80.01,60.96
N$20  (via drill 0.25)
  Top 0.254: SV3.13 87,26.67 | 87,26.67 v84.45,26.67 80.64,22.86 v80.64,18.41 79.38,18.41 78.74,17.78 IC4.20 | SV4.13 97.16,26.67 92.08,26.67 | 92.08,26.67 87,26.67 | R2.1 92.08,26.67
  Bottom 0.254: IC4.20 78.74,17.78 79.38,18.41 v80.64,18.41 | v84.45,26.67 84.45,46.99 SV2.13 87,49.53 94.61,49.53 SV1.13 94.61,46.99 94.61,34.29 97.16,31.75 97.16,29.84 98.42,28.57 SV4.13
N$21  (via drill 0.25)
  Top 0.254: 87,29.21 SV3.15 88.27,37.47 85.72,40.01 SV2.15 | 87,29.21 84.45,29.21 79.38,24.13 | 79.38,24.13 v79.38,19.68 IC4.23 | 87,29.21 97.16,29.21 SV4.15 98.42,36.83 95.89,39.37 SV1.15 | R3.1 79.38,24.13
  Bottom 0.254: IC4.23 v79.38,19.68
N$22  (via drill 0.25)
  Top 0.254: IC5.22 v82.55,6.99 92.71,6.99 95.89,10.16 SV4.2
  Bottom 0.254: IC5.22 v82.55,6.99
N$23  (via drill 0.25)
  Top 0.254: IC4.2 v81.92,6.35 93.34,6.35 98.42,11.43 SV4.1
  Bottom 0.254: IC4.2 v81.92,6.35
N$24  (via drill 0.25)
  Top 0.254: SV4.3 97.16,13.97 95.25,13.97 94.61,13.34 94.61,10.16 92.71,8.26 v82.55,8.26 81.92,7.62 79.38,7.62 78.74,8.26 IC5.20
  Bottom 0.254: IC5.20 v82.55,8.26
N$25  (via drill 0.25)
  Top 0.254: IC5.19 79.38,8.89 80.01,8.26 81.28,8.26 81.92,8.89 v83.19,8.89 92.08,8.89 93.98,10.79 93.98,15.24 95.25,16.51 97.16,16.51 SV4.5
  Bottom 0.254: IC5.19 v83.19,8.89
N$26  (via drill 0.25)
  Top 0.254: IC5.17 79.38,10.16 80.01,10.79 81.28,10.79 81.92,10.16 v83.19,10.16 92.08,10.16 93.34,11.43 93.34,15.88 95.25,17.78 SV4.6
  Bottom 0.254: IC5.17 v83.19,10.16
N$27  (via drill 0.25)
  Top 0.254: IC4.22 v80.01,19.05 80.01,23.5 84.45,27.94 SV3.14 | SV2.14 89.53,46.99 92.08,46.99 | 92.08,46.99 97.16,46.99 SV1.14 | R6.2 92.08,46.99
  Bottom 0.254: IC4.22 v80.01,19.05 | SV3.14 87,29.21 90.17,29.21 | 90.17,29.21 93.98,29.21 95.25,27.94 SV4.14 | SV2.14 90.17,46.35 90.17,29.21
N$28  (via drill 0.25)
  Top 0.254: IC4.9 78.74,10.79 79.38,11.43 81.92,11.43 v82.55,10.79 91.44,10.79 92.71,12.06 92.71,16.51 95.25,19.05 97.16,19.05 SV4.7
  Bottom 0.254: IC4.9 v82.55,10.79
N$29
  Bottom 0.254: IC2.47 66.67,69.85 63.5,73.03 51.38,73.03 50.74,72.39 IC10.7 34.92,72.39 | IC6.2 28.57,69.85 31.11,72.39 34.92,72.39 | R11.1 34.92,72.89 34.92,72.39
N$30  (via drill 0.25)
  Top 0.254: IC7.41 v15.88,60.33 14.61,59.05 14.61,44.45 6.99,36.83 SV5.22
  Bottom 0.254: IC7.41 v15.88,60.33
N$31
  Bottom 0.254: IC2.44 66.04,67.94 62.87,71.12 IC10.3 52.07,71.12 51.44,70.48 34.92,70.48 | IC6.5 29.21,67.94 31.75,70.48 34.92,70.48 | R12.2 34.92,69.98 34.92,70.48
N$32  (via drill 0.25)
  Top 0.254: IC4.11 v83.82,12.06 84.45,11.43 87,11.43 SV3.1
  Bottom 0.254: IC4.11 v83.82,12.06
N$33
  Top 0.254: IC5.13 SV3.2
  Bottom 0.254: IC5.13 SV3.2
N$34  (via drill 0.25)
  Top 0.254: IC6.33 v16.51,60.96 15.24,60.96 13.97,59.69 13.97,45.09 6.99,38.1 5.08,38.1 SV5.21
  Bottom 0.254: IC6.33 v16.51,60.96
N$35
  Bottom 0.254: IC2.41 63.5,66.04 62.87,66.67 51.44,66.67 50.8,66.04 IC11.7 34.92,66.04 | 34.92,66.04 IC6.8 | R15.1 34.92,66.54 34.92,66.04
N$36  (via drill 0.25)
  Top 0.254: SV3.3 87,13.97 84.45,13.97 v83.82,13.34 IC5.12
  Bottom 0.254: IC5.12 v83.82,13.34
N$37  (via drill 0.25)
  Top 0.254: IC5.11 v83.19,13.97 83.82,14.61 83.82,15.24 85.09,16.51 87,16.51 SV3.5
  Bottom 0.254: IC5.11 v83.19,13.97
N$38  (via drill 0.25)
  Top 0.254: SV3.6 85.09,17.78 83.19,15.88 83.19,15.24 v82.55,14.61 80.01,14.61 79.38,15.24 IC5.9
  Bottom 0.254: IC5.9 79.38,15.24 80.01,14.61 v82.55,14.61
N$39  (via drill 0.25)
  Top 0.254: IC5.8 79.38,15.88 80.01,15.24 v81.92,15.24 82.55,15.88 82.55,16.51 85.09,19.05 87,19.05 SV3.7
  Bottom 0.254: IC5.8 79.38,15.88 80.01,15.24 v81.92,15.24
N$40  (via drill 0.25)
  Top 0.254: SV5.19 5.08,40.64 6.99,40.64 13.34,46.99 13.34,60.33 15.24,62.23 v15.88,62.23 IC7.38
  Bottom 0.254: IC7.38 v15.88,62.23
N$41
  Bottom 0.254: IC6.11 34.92,64.14 | 34.92,64.14 51.44,64.14 52.07,64.77 IC11.3 66.67,64.77 67.31,64.14 IC2.38 | R13.2 34.92,63.63 34.92,64.14
N$42
  Top 0.254: IC18.2 32.38,49.53 33.02,50.16 33.02,52.7 33.34,53.02 IC16.4
N$43
  Bottom 0.254: IC2.36 62.23,62.87 59.69,60.33 51.44,60.33 50.8,59.69 IC12.7 34.92,59.69 | IC6.13 29.84,62.87 33.02,59.69 34.92,59.69 | R16.1 34.92,60.19 34.92,59.69
N$44  (via drill 0.25)
  Top 0.254: SV5.18 12.7,48.26 12.7,60.96 14.61,62.87 v16.51,62.87 IC6.36
  Bottom 0.254: IC6.36 v16.51,62.87
N$45
  Bottom 0.254: IC2.33 62.87,60.96 60.33,58.42 IC12.3 52.07,58.42 51.44,57.78 34.92,57.78 | 34.92,57.78 32.38,57.78 29.21,60.96 IC6.16 | R14.2 34.92,57.28 34.92,57.78
N$46
  Bottom 0.254: IC19.2 32.38,49.53 33.02,50.16 33.02,54.61 33.34,54.92 IC17.4
N$47
  Top 0.254: IC7.23 28.57,69.85 31.75,73.03 45.09,73.03 45.72,72.39 IC15.7 57.15,72.39 | 57.15,72.39 64.14,72.39 66.67,69.85 IC3.26 | R17.1 57.15,72.89 57.15,72.39
N$49
  Top 0.254: IC7.20 29.21,67.94 32.38,71.12 IC15.3 44.45,71.12 45.09,70.48 57.15,70.48 | 57.15,70.48 63.5,70.48 65.41,68.58 66.67,68.58 67.31,67.94 IC3.29 | R18.2 57.15,69.98 57.15,70.48
N$50  (via drill 0.25)
  Top 0.254: SV5.16 6.99,44.45 12.06,49.53 12.06,61.59 13.97,63.5 v15.88,63.5 IC6.37
  Bottom 0.254: IC6.37 v15.88,63.5
N$51
  Top 0.254: IC7.17 27.94,66.04 28.57,66.67 45.09,66.67 45.72,66.04 IC14.7 57.15,66.04 | 57.15,66.04 64.14,66.04 64.77,65.41 66.04,65.41 66.67,66.04 IC3.32 | R19.1 57.15,66.54 57.15,66.04
N$52  (via drill 0.25)
  Top 0.254: SV5.15 5.08,45.72 6.99,45.72 11.43,50.16 11.43,62.23 13.34,64.14 v16.51,64.14 IC7.35
  Bottom 0.254: IC7.35 v16.51,64.14
N$53
  Top 0.254: IC7.14 28.57,64.14 29.21,64.77 IC14.3 44.45,64.77 45.09,64.14 57.15,64.14 | 57.15,64.14 IC3.35 | R20.2 57.15,63.63 57.15,64.14
N$54  (via drill 0.25)
  Top 0.254: SV5.13 5.08,48.26 6.99,48.26 10.79,52.07 10.79,62.87 13.34,65.41 v15.88,65.41 IC6.40
  Bottom 0.254: IC6.40 v15.88,65.41
N$55
  Top 0.254: IC7.12 29.84,62.87 32.38,60.33 45.09,60.33 45.72,59.69 IC13.7 57.15,59.69 | 57.15,59.69 59.05,59.69 62.23,62.87 IC3.37 | R21.1 57.15,60.19 57.15,59.69
N$57
  Top 0.254: IC7.9 29.21,60.96 31.75,58.42 IC13.3 44.45,58.42 45.09,57.78 57.15,57.78 | 57.15,57.78 59.69,57.78 63.5,61.59 66.67,61.59 67.31,60.96 IC3.40 | R22.2 57.15,57.28 57.15,57.78
N$58  (via drill 0.25)
  Top 0.254: SV5.12 6.99,49.53 10.16,52.7 10.16,63.5 12.7,66.04 v16.51,66.04 IC6.41
  Bottom 0.254: IC6.41 v16.51,66.04
N$59  (via drill 0.25)
  Top 0.254: SV5.11 5.08,50.8 6.99,50.8 9.53,53.34 9.53,64.14 12.7,67.31 v15.88,67.31 IC7.30
  Bottom 0.254: IC7.30 v15.88,67.31
N$60  (via drill 0.25)
  Top 0.254: SV5.10 8.89,54.61 8.89,64.77 12.06,67.94 v16.51,67.94 IC6.44
  Bottom 0.254: IC6.44 v16.51,67.94
N$61  (via drill 0.25)
  Top 0.254: SV5.8 8.26,56.52 8.26,65.41 12.06,69.22 v15.88,69.22 IC6.46
  Bottom 0.254: IC6.46 v15.88,69.22
N$62  (via drill 0.25)
  Top 0.254: SV5.7 5.08,55.88 5.08,57.78 5.71,58.42 6.99,58.42 7.62,59.05 7.62,66.04 11.43,69.85 v16.51,69.85 IC7.26
  Bottom 0.254: IC7.26 v16.51,69.85
N$63  (via drill 0.25)
  Top 0.254: IC1.90 36.47,37.1 35.56,36.2 33.66,36.2 SV6.5 27.2,40.11 SW1.4 | v27.94,31.75 27.2,31.01 SW1.3
  Bottom 0.254: v27.94,31.75 31.11,34.92 SV6.5
N$64
  Top 0.254: IC8.3 29.21,6.99 32.38,3.81 IC22.3 44.45,3.81 45.09,3.17 60.96,3.17 | IC4.46 66.67,6.99 62.87,3.17 60.96,3.17 | R28.2 60.96,2.67 60.96,3.17
N$65
  Top 0.254: IC8.6 29.84,8.89 33.02,5.71 45.09,5.71 45.72,5.08 IC22.7 60.96,5.08 | IC4.43 66.67,8.89 66.04,8.26 65.41,8.26 62.23,5.08 60.96,5.08 | R27.1 60.96,5.58 60.96,5.08
N$66
  Top 0.508: LED3.A R37.2
N$67
  Top 0.508: LED2.A R36.2
N$68
  Top 0.254: IC8.9 28.57,10.79 29.21,10.16 IC21.3 44.45,10.16 45.09,9.53 60.96,9.53 | IC4.40 67.31,10.79 66.67,11.43 63.5,11.43 61.59,9.53 60.96,9.53 | R26.2 60.96,9.03 60.96,9.53
N$69
  Top 0.508: LED1.A R35.2
N$70
  Top 0.254: IC8.12 29.21,12.7 29.84,12.06 45.09,12.06 45.72,11.43 IC21.7 60.96,11.43 61.28,11.75 | 61.28,11.75 62.23,12.7 IC4.37 | R25.1 60.96,12.06 61.28,11.75
N$71
  Top 0.254: R35.1 35.56,28.07 35.56,28.57 39.09,32.1 IC1.100
N$72
  Top 0.254: IC8.14 29.21,13.97 31.75,16.51 IC20.3 44.45,16.51 45.09,15.88 60.96,15.88 61.28,15.56 | 61.28,15.56 62.87,13.97 IC4.35 | R24.2 61.14,15.56 61.28,15.56
N$73
  Top 0.254: R36.1 35.56,29.84 38.31,32.6 IC1.99
N$74
  Top 0.254: IC8.17 28.57,15.88 31.11,18.41 45.09,18.41 45.72,17.78 IC20.7 60.96,17.78 | IC4.32 66.67,15.88 66.04,15.24 64.14,15.24 61.59,17.78 60.96,17.78 | R23.1 60.96,18.28 60.96,17.78
N$75
  Top 0.254: R37.1 36.2,31.75 37.55,33.1 IC1.98
N$76
  Bottom 0.254: 34.92,3.17 52.07,3.17 52.7,3.81 IC23.3 63.5,3.81 66.67,6.99 IC5.27 | 34.92,3.17 33.02,3.17 29.21,6.99 IC9.22 | R30.2 34.92,2.67 34.92,3.17
N$78
  Bottom 0.254: 34.92,5.08 IC23.7 50.8,5.08 51.44,5.71 62.87,5.71 66.04,8.89 IC5.30 | 34.92,5.08 33.66,5.08 29.84,8.89 IC9.19 | R29.1 34.92,5.58 34.92,5.08
N$80
  Bottom 0.254: IC5.33 62.87,10.79 62.23,10.16 IC24.3 52.7,10.16 52.07,9.53 34.92,9.53 | 34.92,9.53 31.75,9.53 30.48,10.79 IC9.16 | R32.2 34.92,9.03 34.92,9.53
N$82
  Bottom 0.254: IC5.36 62.23,12.7 61.59,12.06 51.44,12.06 50.8,11.43 IC24.7 34.92,11.43 | 34.92,11.43 32.38,11.43 31.11,12.7 IC9.13 | R31.1 34.92,11.93 34.92,11.43
N$84
  Bottom 0.254: IC5.38 62.87,13.97 60.33,16.51 IC25.3 52.7,16.51 52.07,15.88 34.92,15.88 | 34.92,15.88 31.11,15.88 29.21,13.97 IC9.11 | R34.2 34.92,15.38 34.92,15.88
N$86
  Bottom 0.254: IC5.41 63.5,15.88 60.96,18.41 51.44,18.41 50.8,17.78 IC25.7 34.92,17.78 | IC9.8 28.57,15.88 30.48,17.78 34.92,17.78 | R33.1 34.92,18.28 34.92,17.78
N$87
  Top 0.254: IC1.89 36.7,37.6 35.56,38.73 33.66,38.73 SV6.1
N$89
  Top 0.254: IC1.38 SV7.1
N$90
  Top 0.254: IC1.37 57.65,37.6 57.78,37.47 65.41,37.47 SV7.2
N$91  (via drill 0.25)
  Top 0.254: SV5.24 6.99,34.29 14.61,26.67 14.61,17.14 v15.88,15.88 IC9.41
  Bottom 0.254: IC9.41 v15.88,15.88
N$93  (via drill 0.25)
  Top 0.254: v15.88,29.21 15.88,57.78 v16.51,58.42 IC6.29
  Bottom 0.254: SV5.28 v15.88,29.21 | IC6.29 v16.51,58.42
N$95  (via drill 0.25)
  Top 0.254: SV5.23 5.08,33.02 6.99,33.02 13.97,26.04 13.97,16.51 15.24,15.24 v16.51,15.24 IC9.40
  Bottom 0.254: IC9.40 v16.51,15.24
N$96  (via drill 0.25)
  Top 0.254: SV5.26 13.34,24.77 13.34,15.88 15.24,13.97 v15.88,13.97 IC8.35
  Bottom 0.254: IC8.35 v15.88,13.97
N$97  (via drill 0.25)
  Top 0.254: SV5.29 5.08,25.4 6.99,25.4 12.7,19.68 12.7,15.24 14.61,13.34 v16.51,13.34 IC9.37
  Bottom 0.254: IC9.37 v16.51,13.34
N$98  (via drill 0.25)
  Top 0.254: SV5.32 6.99,24.13 12.06,19.05 12.06,14.61 13.97,12.7 v15.88,12.7 IC9.36
  Bottom 0.254: IC9.36 v15.88,12.7
N$102  (via drill 0.25)
  Top 0.254: SV5.31 5.08,22.86 6.99,22.86 11.43,18.41 11.43,13.97 13.34,12.06 v16.51,12.06 IC8.38
  Bottom 0.254: IC8.38 v16.51,12.06
N$106  (via drill 0.25)
  Top 0.254: SV5.33 5.08,20.32 6.99,20.32 10.79,16.51 10.79,13.34 13.34,10.79 v15.88,10.79 IC8.40
  Bottom 0.254: IC8.40 v15.88,10.79
N$108  (via drill 0.25)
  Top 0.254: SV5.35 5.08,17.78 6.99,17.78 9.53,15.24 9.53,12.06 12.7,8.89 v15.88,8.89 IC9.30
  Bottom 0.254: IC9.30 v15.88,8.89
N$109  (via drill 0.25)
  Top 0.254: SV5.38 6.99,16.51 8.89,14.61 8.89,11.43 12.06,8.26 v16.51,8.26 IC9.29
  Bottom 0.254: IC9.29 v16.51,8.26
N$110
  Bottom 0.254: IC6.20 27.94,58.42 29.21,57.15 29.21,54.61 | IC17.1 30.8,53.02 29.21,54.61 | R4.1 29.21,54.61
N$111  (via drill 0.25)
  Top 0.254: SV5.37 5.08,15.24 6.99,15.24 8.26,13.97 8.26,10.79 12.06,6.99 v15.88,6.99 IC9.27
  Bottom 0.254: IC9.27 v15.88,6.99
N$112  (via drill 0.25)
  Top 0.254: SV5.40 7.62,12.7 7.62,10.16 11.43,6.35 v16.51,6.35 IC9.26
  Bottom 0.254: IC9.26 v16.51,6.35
N$113
  Top 0.254: IC7.5 27.94,58.42 29.84,56.52 | IC16.1 31.43,54.92 29.84,56.52 | R5.1 29.84,56.52
N$118  (via drill 0.25)
  Top 0.254: SV5.36 6.99,19.05 10.16,15.88 10.16,12.7 12.7,10.16 v16.51,10.16 IC9.32
  Bottom 0.254: IC9.32 v16.51,10.16
OE  (via drill 0.25)
  Top 0.254: IC1.36 57.52,37.1 62.23,32.38 62.23,24.13 v66.67,19.68 IC4.26
  Bottom 0.254: IC4.26 v66.67,19.68
OEN0  (via drill 0.25)
  Top 0.254: v73.66,19.05 v73.66,6.99 | IC1.41 58.02,39.6 58.42,40.01 71.12,40.01 | 71.12,40.01 v73.66,40.01 | v73.66,68.58 v73.66,57.78 | R40.1 71.12,40.01
  Bottom 0.254: IC5.25 73.66,5.71 | 73.66,5.71 IC5.24 | IC5.48 73.66,20.32 | IC5.1 73.66,20.32 | 73.66,20.32 v73.66,19.05 | v73.66,6.99 73.66,5.71 | 73.66,20.32 v73.66,40.01 73.66,55.88 | 73.66,55.88 IC2.24 | IC2.25 73.66,55.88 | IC2.1 73.66,70.48 | 73.66,70.48 IC2.48 | 73.66,70.48 v73.66,68.58 | v73.66,57.78 73.66,55.88
OEN1
  Top 0.254: IC4.25 74.93,20.32 | IC4.24 74.93,20.32 | IC4.48 74.93,5.71 | 74.93,5.71 IC4.1 | 74.93,5.71 74.93,20.32 | 74.93,20.32 74.93,39.37 | IC1.40 58.78,39.1 59.05,39.37 72.39,39.37 | 72.39,39.37 74.93,39.37 | 74.93,39.37 74.93,55.88 | 74.93,55.88 74.93,70.48 | 74.93,70.48 IC3.24 | IC3.25 74.93,70.48 | IC3.48 74.93,55.88 | IC3.1 74.93,55.88 | R41.1 72.39,39.37
PB0  (via drill 0.25)
  Top 0.254: IC1.5 43.62,27.11 v38.1,21.59
  Route15 0.254: v38.1,14.61 v38.1,21.59
  Bottom 0.254: IC9.12 29.84,13.34 31.11,14.61 v38.1,14.61 47.62,14.61 48.26,15.24 IC25.5 52.7,15.24 53.34,15.88 59.69,15.88 62.23,13.34 IC5.37
PB1  (via drill 0.25)
  Top 0.254: IC1.6 44.12,26.34 v38.73,20.95
  Route15 0.254: v38.73,8.26 v38.73,20.95
  Bottom 0.254: IC9.17 29.84,10.16 31.75,8.26 v38.73,8.26 47.62,8.26 48.26,8.89 IC24.5 52.7,8.89 53.34,9.53 62.87,9.53 63.5,10.16 IC5.32
PB2  (via drill 0.25)
  Top 0.254: IC1.7 44.62,25.57 v39.37,20.32
  Route15 0.254: v39.37,1.91 v39.37,20.32
  Bottom 0.254: IC9.23 28.57,6.35 33.02,1.91 v39.37,1.91 47.62,1.91 48.26,2.54 IC23.5 52.7,2.54 53.34,3.17 64.14,3.17 67.31,6.35 IC5.26
PB3  (via drill 0.25)
  Top 0.254: IC1.8 45.12,23.54 v43.81,22.23
  Route15 0.254: v43.81,17.14 v43.81,22.23
  Bottom 0.254: IC5.40 62.87,15.24 60.33,17.78 IC25.2 52.07,17.78 51.44,17.14 v43.81,17.14 31.11,17.14 29.21,15.24 IC9.9
PB4  (via drill 0.25)
  Top 0.254: IC1.9 45.62,22.77 v44.45,21.59
  Route15 0.254: v43.81,10.79 44.45,11.43 v44.45,21.59
  Bottom 0.254: IC5.35 62.87,12.06 62.23,11.43 IC24.2 52.07,11.43 51.44,10.79 v43.81,10.79 31.75,10.79 30.48,12.06 IC9.14
PB5  (via drill 0.25)
  Top 0.254: IC1.10 46.12,22 v45.09,20.95
  Route15 0.254: v43.81,4.45 45.09,5.71 v45.09,20.95
  Bottom 0.254: IC9.20 29.21,8.26 33.02,4.45 v43.81,4.45 51.44,4.45 52.07,5.08 IC23.2 63.5,5.08 66.67,8.26 IC5.29
PB7  (via drill 0.25)
  Top 0.254: IC1.12 47.12,20.45 v46.99,20.32
  Route15 0.254: v36.83,2.54 v36.83,6.35 v36.83,8.89 v36.83,12.7 v36.83,15.24 v36.83,19.05 | v46.99,13.97 v46.99,20.32
  Bottom 0.254: R30.1 v36.83,2.54 | R29.2 36.7,6.35 v36.83,6.35 | R32.1 v36.83,8.89 | R31.2 36.7,12.7 v36.83,12.7 38.1,13.97 v46.99,13.97 | R34.1 v36.83,15.24 | R33.2 36.7,19.05 v36.83,19.05
PC0  (via drill 0.25)
  Top 0.254: IC8.5 29.21,8.26 32.38,5.08 IC22.2 44.45,5.08 45.09,4.45 v52.7,4.45 62.87,4.45 66.04,7.62 66.67,7.62 67.31,8.26 IC4.44 | IC1.15 48.62,23.77 v51.44,20.95
  Route15 0.254: v52.7,4.45 51.44,5.71 v51.44,20.95
PC1  (via drill 0.25)
  Top 0.254: IC8.11 28.57,12.06 29.21,11.43 IC21.2 44.45,11.43 45.09,10.79 v52.7,10.79 61.59,10.79 62.87,12.06 IC4.38 | IC1.16 49.12,24.54 v52.07,21.59
  Route15 0.254: v52.7,10.79 52.07,11.43 v52.07,21.59
PC2  (via drill 0.25)
  Top 0.254: IC8.16 29.21,15.24 31.75,17.78 IC20.2 44.45,17.78 45.09,17.14 v52.7,17.14 60.96,17.14 63.5,14.61 66.67,14.61 67.31,15.24 IC4.33 | IC1.17 49.62,25.3 v52.7,22.23
  Route15 0.254: v52.7,17.14 v52.7,22.23
PC3  (via drill 0.25)
  Top 0.254: IC8.2 28.57,6.35 31.75,3.17 43.81,3.17 44.45,2.54 IC22.5 48.26,2.54 48.9,1.91 v57.15,1.91 62.87,1.91 67.31,6.35 IC4.47 | IC1.18 50.12,27.34 56.52,20.95 v57.15,20.95
  Route15 0.254: v57.15,1.91 v57.15,20.95
PC4  (via drill 0.25)
  Top 0.254: IC8.8 27.94,10.16 28.57,9.53 43.81,9.53 44.45,8.89 IC21.5 48.26,8.89 48.9,8.26 v57.78,8.26 61.59,8.26 64.14,10.79 66.04,10.79 66.67,10.16 IC4.41 | IC1.19 50.62,28.11 57.15,21.59 v57.78,21.59
  Route15 0.254: v57.78,8.26 v57.78,21.59
PC5  (via drill 0.25)
  Top 0.254: IC8.13 29.84,13.34 32.38,15.88 43.81,15.88 44.45,15.24 IC20.5 48.26,15.24 48.9,14.61 v58.42,14.61 60.96,14.61 62.23,13.34 IC4.36 | IC1.20 51.12,28.89 57.78,22.23 v58.42,22.23
  Route15 0.254: v58.42,14.61 v58.42,22.23
PC7  (via drill 0.25)
  Top 0.254: R28.1 v59.05,2.54 | R27.2 59.19,6.35 v59.05,6.35 | R26.1 v59.05,8.89 | R25.2 59.19,12.7 v59.05,12.7 | R24.1 v59.05,15.24 | R23.2 59.19,19.05 v59.05,19.05 | v59.05,22.86 58.42,22.86 52.12,29.16 IC1.22
  Route15 0.254: v59.05,2.54 v59.05,6.35 v59.05,8.89 v59.05,12.7 v59.05,15.24 v59.05,19.05 v59.05,22.86
PH0  (via drill 0.25)
  Top 0.254: IC7.11 29.21,62.23 31.75,59.69 IC13.2 44.45,59.69 45.09,59.05 v58.42,59.05 59.69,59.05 62.87,62.23 IC3.38 | IC1.55 51.62,47.18 v58.42,53.98
  Route15 0.254: v58.42,59.05 v58.42,53.98
PH1  (via drill 0.25)
  Top 0.254: IC7.16 28.57,65.41 29.21,66.04 IC14.2 44.45,66.04 45.09,65.41 v57.78,65.41 63.5,65.41 64.14,64.77 66.67,64.77 67.31,65.41 IC3.33 | IC1.56 51.12,47.95 v57.78,54.61
  Route15 0.254: v57.78,65.41 v57.78,54.61
PH2  (via drill 0.25)
  Top 0.254: IC7.22 29.21,69.22 32.38,72.39 IC15.2 44.45,72.39 45.09,71.75 v57.15,71.75 63.5,71.75 66.04,69.22 IC3.27 | IC1.57 50.62,48.72 v57.15,55.24
  Route15 0.254: v57.15,71.75 v57.15,55.24
PH3  (via drill 0.25)
  Top 0.254: IC1.58 50.12,50.76 v53.34,53.98
  Route15 0.254: v52.07,69.85 53.34,68.58 v53.34,53.98
  Bottom 0.254: IC2.43 65.41,67.31 62.23,70.48 52.7,70.48 v52.07,69.85 IC10.5 48.2,69.85 47.56,69.22 31.75,69.22 29.84,67.31 IC6.6
PH4  (via drill 0.25)
  Top 0.254: IC1.59 49.62,51.53 v52.7,54.61
  Route15 0.254: v52.07,63.5 52.7,62.87 v52.7,54.61
  Bottom 0.254: IC2.37 66.67,63.5 66.04,64.14 52.7,64.14 v52.07,63.5 IC11.5 48.26,63.5 47.62,62.87 31.11,62.87 30.48,63.5 IC6.12
PH5  (via drill 0.25)
  Top 0.254: IC1.60 49.12,52.3 v52.07,55.24
  Route15 0.254: v52.07,57.15 v52.07,55.24
  Bottom 0.254: IC2.32 63.5,60.33 60.96,57.78 52.7,57.78 v52.07,57.15 IC12.5 48.26,57.15 47.62,56.52 32.38,56.52 28.57,60.33 IC6.17
PH6  (via drill 0.25)
  Top 0.254: R17.2 58.92,73.66 v59.05,73.66 | R18.1 v59.05,69.85 | R19.2 58.92,67.31 v59.05,67.31 | R20.1 v59.05,63.5 | R21.2 58.92,60.96 v59.05,60.96 | R22.1 v59.05,57.15 | v50.16,54.61 48.62,53.07 IC1.61
  Route15 0.254: v59.05,73.66 v59.05,69.85 v59.05,67.31 v59.05,63.5 v59.05,60.96 v59.05,57.15 | v50.16,62.23 v50.16,54.61
  Bottom 0.254: v50.16,62.23 57.78,62.23 v59.05,60.96
PH7  (via drill 0.25)
  Top 0.254: v37.47,57.15 38.73,55.88 46.35,55.88 48.12,54.11 IC1.62
  Route15 0.254: v37.47,73.66 v37.47,69.85 v37.47,67.31 v37.47,63.5 v37.47,60.96 v37.47,57.15
  Bottom 0.254: R11.2 36.7,73.66 v37.47,73.66 | R12.1 v37.47,69.85 | R13.1 v37.47,63.5 | R16.2 36.7,60.96 v37.47,60.96 | R14.1 v37.47,57.15 | R15.2 36.7,67.31 v37.47,67.31
PJ2  (via drill 0.25)
  Top 0.254: IC3.41 66.67,60.33 66.04,60.96 64.14,60.96 59.69,56.52 48.9,56.52 48.26,57.15 IC13.5 v44.45,57.15 43.81,57.78 31.11,57.78 28.57,60.33 IC7.8 | IC1.67 45.62,54.07 v44.45,55.24
  Route15 0.254: v44.45,57.15 v44.45,55.24
PJ3  (via drill 0.25)
  Top 0.254: IC7.13 29.21,63.5 29.84,64.14 43.81,64.14 v44.45,63.5 IC14.5 48.26,63.5 48.9,62.87 60.96,62.87 61.59,63.5 IC3.36 | IC1.68 45.12,53.3 v43.81,54.61
  Route15 0.254: v44.45,63.5 43.81,62.87 v43.81,54.61
PJ4  (via drill 0.25)
  Top 0.254: IC3.30 66.67,67.31 66.04,67.94 64.77,67.94 63.5,69.22 48.9,69.22 48.26,69.85 IC15.5 v44.45,69.85 43.81,70.48 33.02,70.48 29.84,67.31 IC7.19 | IC1.69 44.62,52.53 v43.18,53.98
  Route15 0.254: v44.45,69.85 43.18,68.58 v43.18,53.98
PJ5  (via drill 0.25)
  Top 0.254: IC1.70 44.12,49.85 v39.37,54.61
  Route15 0.254: v39.37,71.75 v39.37,54.61
  Bottom 0.254: IC2.46 66.04,69.22 62.87,72.39 IC10.2 52.07,72.39 51.44,71.75 v39.37,71.75 31.75,71.75 29.21,69.22 IC6.3
PJ6  (via drill 0.25)
  Top 0.254: IC1.71 43.62,49.09 v38.73,53.98
  Route15 0.254: v38.73,65.41 v38.73,53.98
  Bottom 0.254: IC2.40 62.87,65.41 62.23,66.04 IC11.2 52.07,66.04 51.44,65.41 v38.73,65.41 IC6.9
PJ7  (via drill 0.25)
  Top 0.254: IC1.72 43.12,48.31 v38.1,53.34
  Route15 0.254: v38.1,59.05 v38.1,53.34
  Bottom 0.254: IC2.35 62.87,62.23 60.33,59.69 IC12.2 52.07,59.69 51.44,59.05 v38.1,59.05 32.38,59.05 29.21,62.23 IC6.14
SCLK0  (via drill 0.25)
  Top 0.254: IC1.32 54.78,35.1 54.61,34.92 v48.9,34.92
  Route15 0.254: v50.8,71.12 v50.8,64.77 v50.8,58.42 v50.8,55.24 | v50.8,3.81 v50.8,10.16 v50.8,16.51 v50.8,20.32
  Bottom 0.254: IC10.6 v50.8,71.12 | IC11.6 v50.8,64.77 | IC12.6 v50.8,58.42 | v50.8,55.24 50.8,52.7 48.9,50.8 | IC19.4 35.24,50.48 35.56,50.8 48.9,50.8 | 48.9,50.8 v48.9,34.92 48.9,22.23 v50.8,20.32 63.5,20.32 65.41,18.41 66.67,18.41 67.31,17.78 IC5.44 | IC25.6 v50.8,16.51 | IC24.6 v50.8,10.16 | IC23.6 v50.8,3.81
SCLK1  (via drill 0.25)
  Top 0.254: IC15.6 v45.72,71.12 | IC14.6 v45.72,64.77 | IC13.6 v45.72,58.42 | IC18.4 35.24,48.58 36.2,49.53 v36.2,50.16 | IC1.42 54.7,40.1 54.61,40.01 v46.35,40.01 | IC22.6 v45.72,3.81 | IC20.6 v45.72,16.51 | IC21.6 v45.72,10.16 | IC4.29 69.85,17.78 v70.48,17.14 | v64.77,17.78 62.87,19.68 46.35,19.68 v45.72,20.32 | v45.72,55.24 46.35,54.61 v46.35,50.16
  Route15 0.254: v45.72,71.12 v45.72,64.77 v45.72,58.42 v45.72,55.24 | v45.72,3.81 v45.72,10.16 v45.72,16.51 v45.72,20.32 | v70.48,17.14 65.41,17.14 v64.77,17.78
  Bottom 0.254: v45.72,20.32 46.35,20.95 v46.35,40.01 v46.35,50.16 v36.2,50.16
VCC  (via drill 0.25)
  Top 0.254: IC7.18 v25.4,66.67 | IC7.7 v25.4,59.69 | IC7.42 v19.05,59.69 | IC7.31 v19.05,66.67 | IC1.54 52.12,45.14 52.07,45.09 v52.07,43.81 | IC1.34 54.7,36.1 54.61,36.2 v53.34,36.2 | IC1.64 47.12,45.22 46.99,45.09 v46.99,43.81 | IC1.44 54.78,41.1 54.61,41.27 v53.34,41.27 | IC9.42 v19.05,16.51 | v25.4,16.51 IC9.7 | v25.4,9.53 IC9.18 | IC9.31 v19.05,9.53 | IC1.74 42.12,44.03 v41.91,43.81 | IC1.83 39.66,40.64 v41.91,40.64 | IC1.94 40.47,35.1 40.64,34.92 v41.91,34.92 | IC1.4 43.12,31.06 43.18,31.11 v43.18,32.38 | IC1.14 48.12,30.98 48.26,31.11 v48.26,32.38 | IC1.24 53.12,32.17 v53.34,32.38 | R38.1 v28.57,45.09 | R39.1 v29.84,40.64 | R41.2 v72.39,37.47 | R40.2 v71.12,41.91 | R43.1 v21.59,42.55 | R44.2 38.6,49.4 v38.73,49.53 | R45.2 35.7,46.49 v35.56,46.35
  Top 0.508: IC15.8 v48.26,73.66 C12.1 | IC14.8 v48.26,67.31 C11.1 | IC13.8 v48.26,60.96 C10.1 | IC16.5 34.32,54.01 v34.29,53.98 | IC20.8 v48.26,19.05 48.27,19.04 C13.1 | IC21.8 v48.26,12.7 C14.1 | IC22.8 v48.26,6.35 C15.1 | C16.1 v20.95,72.39 | C17.1 v20.95,53.98 | C18.1 v20.95,22.23 | C19.1 v20.95,3.81
  Top 0.61: IC18.5 34.32,49.56 v34.29,49.53 | R5.2 28.71,56.02 v28.57,55.88
  Bottom 0.254: IC7.31 v19.05,66.67 | IC7.42 v19.05,59.69 | IC7.18 v25.4,66.67 | IC7.7 v25.4,59.69 | IC9.31 v19.05,9.53 | IC9.42 v19.05,16.51 | IC9.7 v25.4,16.51 | IC9.18 v25.4,9.53
  Bottom 0.508: IC10.8 v48.26,73.66 | IC11.8 v48.26,67.31 | IC12.8 v48.26,60.96 | IC17.5 34.32,53.95 v34.29,53.98 | IC25.8 v48.26,19.05 | IC23.8 v48.26,6.35 | IC24.8 v48.26,12.7 | C23.1 41.9,43.8 v41.91,43.81 | C22.1 52.05,43.8 v52.07,43.81 | C20.1 43.2,32.4 v43.18,32.38 | C21.1 53.35,32.4 v53.34,32.38
  Bottom 0.61: IC19.5 34.29,48.61 v34.29,49.53 | R4.2 v27.3,54.61
  pour Route15 (isolate 0.406, no thermals): 100.33,74.93 100.33,1.27 1.27,1.27 1.27,74.93
VCC/2  (via drill 0.25)
  Top 0.254: IC3.18 v79.38,66.67 C1.1 | IC3.7 v79.38,59.69 C2.1 | C4.1 v66.67,66.67 IC3.31 | C3.1 v66.67,59.69 IC3.42 | IC5.42 v66.67,16.51 C8.1 | IC5.31 v66.67,9.53 C7.1 | C6.1 v79.38,9.53 IC5.18 | IC5.7 v79.38,16.51 C5.1 | C9.1 78.11,26.02
  Top 0.508: 78.11,26.02 v78.11,25.4 78.11,24.27 R3.2
  Bottom 0.254: v79.38,66.67 IC3.18 73.03,66.67 | v79.38,59.69 IC3.7 73.03,59.69 | v66.67,66.67 IC3.31 73.03,66.67 | v66.67,59.69 IC3.42 73.03,59.69 | 73.03,59.69 73.03,66.67 | v66.67,16.51 IC5.42 73.03,16.51 | 73.03,16.51 IC5.7 v79.38,16.51 | v66.67,9.53 IC5.31 73.03,9.53 | 73.03,9.53 IC5.18 v79.38,9.53 | 73.03,16.51 73.03,9.53
  Bottom 0.61: v79.38,16.51 80.01,16.51 81.92,18.41 81.92,25.4 | 81.92,57.78 80.01,59.69 v79.38,59.69 | 81.92,25.4 81.92,57.78 | 81.92,25.4 v78.11,25.4 | SV5.4 SV5.2 6.35,68.58 12.65,74.88 80.7,74.88 87,68.58 87,66.67 83.19,62.87 83.19,59.05 81.92,57.78
VSYNC  (via drill 0.25)
  Top 0.254: IC7.43 v15.88,59.05 | IC1.80 37.66,42.1 37.47,41.91 v36.2,41.91 | v26.04,41.91 v24.13,41.91 23.5,42.55 R43.2
  Bottom 0.254: SV5.3 5.08,58.42 6.99,58.42 7.62,59.05 v15.88,59.05 IC7.43 19.05,59.05 22.23,55.88 22.23,43.81 v24.13,41.91 | v26.04,41.91 v36.2,41.91